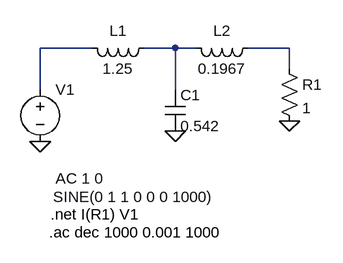
[diagram p0: schematic Circuito.asc]
Circuito.asc, the LTspice schematic file:
Version 4
SHEET 1 880 680
WIRE 112 96 32 96
WIRE 240 96 192 96
WIRE 272 96 240 96
WIRE 416 96 352 96
WIRE 416 128 416 96
WIRE 32 160 32 96
WIRE 240 160 240 96
FLAG 32 240 0
FLAG 416 208 0
FLAG 240 224 0
SYMBOL ind 96 80 M90
WINDOW 0 5 56 VBottom 2
WINDOW 3 32 56 VTop 2
SYMATTR InstName L1
SYMATTR Value 1.25
SYMBOL ind 368 80 R90
WINDOW 0 5 56 VBottom 2
WINDOW 3 32 56 VTop 2
SYMATTR InstName L2
SYMATTR Value 0.1967
SYMBOL res 400 112 R0
SYMATTR InstName R1
SYMATTR Value 1
SYMBOL cap 224 160 R0
SYMATTR InstName C1
SYMATTR Value 0.542
SYMBOL voltage 32 144 R0
WINDOW 3 20 181 Left 2
WINDOW 123 24 153 Left 2
WINDOW 39 0 0 Left 0
SYMATTR InstName V1
SYMATTR Value SINE(0 1 1 0 0 0 1000)
SYMATTR Value2 AC 1 0
TEXT 48 352 Left 2 !.net I(R1) V1
TEXT 46 380 Left 2 !.ac dec 1000 0.001 1000

The netlist it stands for:
* Circuito.asc
L1 N001 N002 1.25
L2 N003 N002 0.1967
R1 N003 0 1
C1 N002 0 0.542
V1 N001 0 SINE(0 1 1 0 0 0 1000) AC 1 0
.net I(R1) V1
.ac dec 1000 0.001 1000
.backanno
.end